# Altium schematic sheet TSAL23-ESF-2.SchDoc
size A4
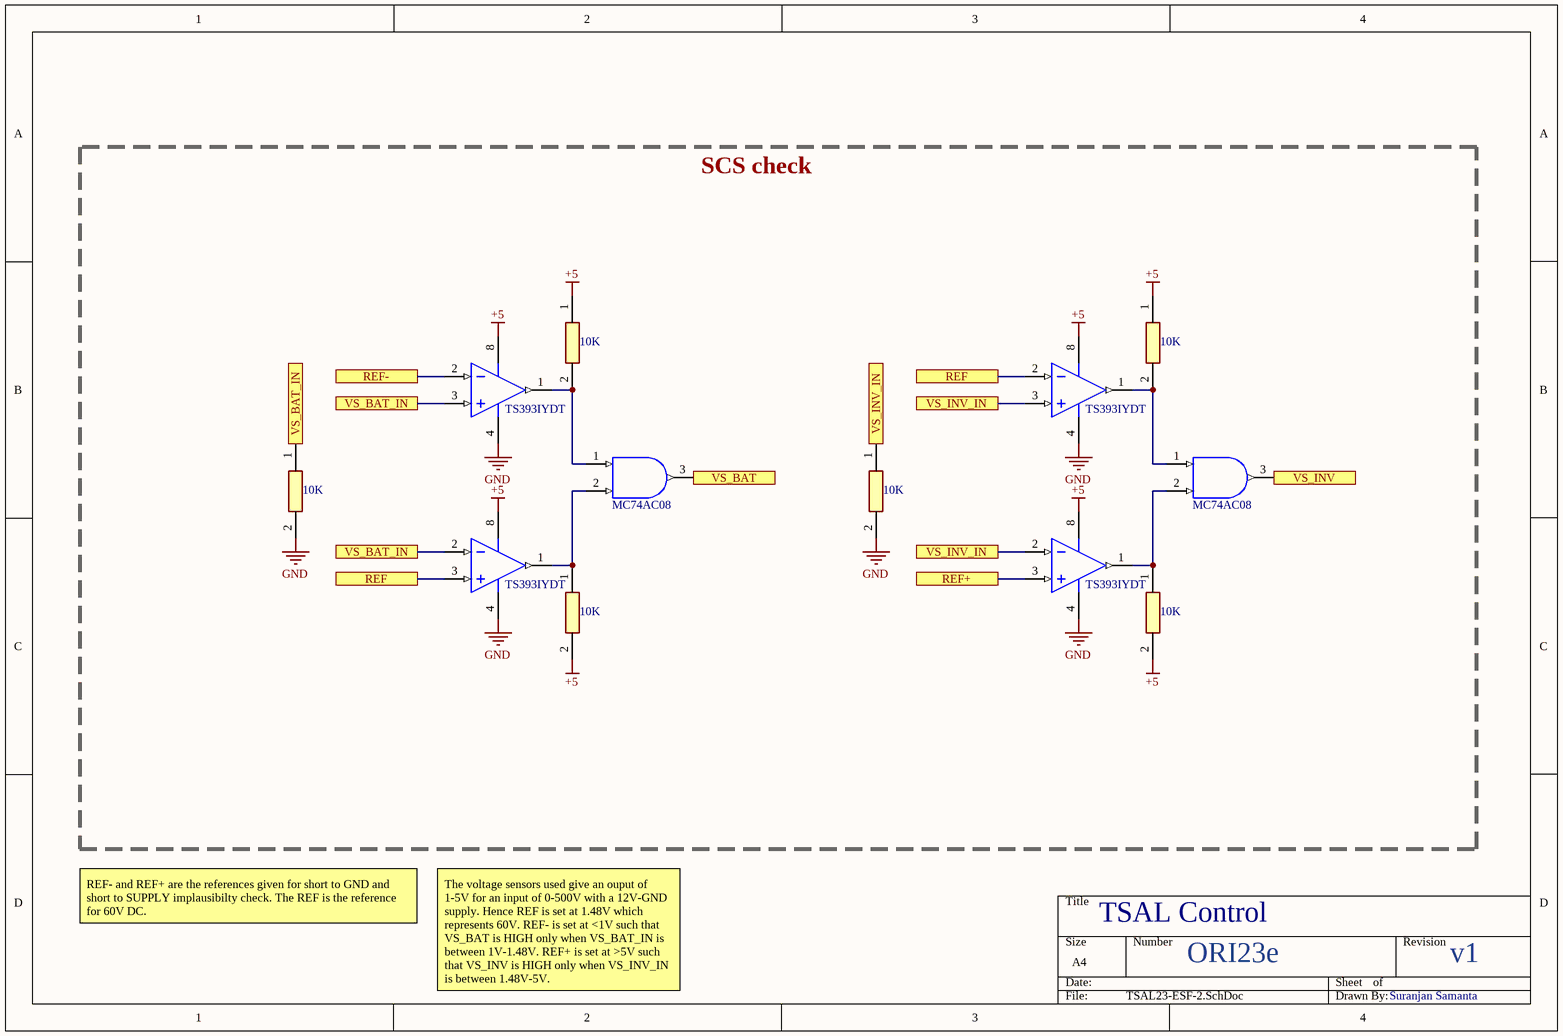
[diagram p0: TSAL23-ESF-2.SchDoc]

## Parts
(Parts that share a designator on the sheet are numbered #1, #2 ... from top to bottom, then left to right.)
R?#1  10K  [RESC3126X60N]
R?#2  10K  [RESC3126X60N]
R?#3  10K  [RESC3126X60N]
R?#4  10K  [RESC3126X60N]
R?#5  10K  [RESC3126X60N]
R?#6  10K  [RESC3126X60N]
U?#1  TS393IYDT  [STM-SO-8_D_L]  (part A of 2)
U?#2  TS393IYDT  [STM-SO-8_D_L]  (part A of 2)
U?#3  MC74AC08  [PW0014A_N]  (part A of 5)
U?#4  MC74AC08  [PW0014A_N]  (part A of 5)
U?#5  TS393IYDT  [STM-SO-8_D_L]  (part A of 2)
U?#6  TS393IYDT  [STM-SO-8_D_L]  (part A of 2)

## Blocks framed on the sheet
SCS check: R?#1-R?#6 U?#1-U?#6

## Ports
REF, REF+, REF-, VS_BAT, VS_BAT_IN, VS_INV, VS_INV_IN

## Nets
+5: R?#1.1 R?#2.1 R?#5.2 R?#6.2 U?#1.8(VCC+) U?#2.8(VCC+) U?#5.8(VCC+) U?#6.8(VCC+)
GND: R?#3.2 R?#4.2 U?#1.4(VCC-) U?#2.4(VCC-) U?#5.4(VCC-) U?#6.4(VCC-)
REF: U?#2.2(IN1-) U?#5.3(IN1+) ; port REF
REF+: U?#6.3(IN1+) ; port REF+
REF-: U?#1.2(IN1-) ; port REF-
VS_BAT: U?#3.3(1Y) ; port VS_BAT
VS_BAT_IN: R?#3.1 U?#1.3(IN1+) U?#5.2(IN1-) ; port VS_BAT_IN
VS_INV: U?#4.3(1Y) ; port VS_INV
VS_INV_IN: R?#4.1 U?#2.3(IN1+) U?#6.2(IN1-) ; port VS_INV_IN
NetR?#1_2: R?#1.2 U?#1.1(OUT1) U?#3.1(1A)
NetR?#2_2: R?#2.2 U?#2.1(OUT1) U?#4.1(1A)
NetR?#5_1: R?#5.1 U?#3.2(1B) U?#5.1(OUT1)
NetR?#6_1: R?#6.1 U?#4.2(1B) U?#6.1(OUT1)

## Notes on the sheet
- REF- and REF+ are the references given for short to GND and short to SUPPLY implausibilty check. The REF is the reference for 60V DC.
- TSAL Control
- The voltage sensors used give an ouput of 1-5V for an input of 0-500V with a 12V-GND supply. Hence REF is set at 1.48V which represents 60V. REF- is set at <1V such that VS_BAT is HIGH only when VS_BAT_IN is between 1V-1.48V. REF+ is set at >5V such that VS_INV is HIGH only when VS_INV_IN is between 1.48V-5V.
- ORI23e
- v1
- Suranjan Samanta

## Library data of the parts
R?#1-R?#6 = RC1210JR-0710KL: Resistor; Manufacturer_Name: YAGEO (PHYCOMP); Datasheet Link: http://www.yageo.com/documents/recent/PYu-RC1210_51_RoHS_L_(4).pdf; Height: 0.6mm; Manufacturer_Part_Number: RC1210JR-0710KL; Mouser Part Number: 603-RC1210JR-0710KL; Mouser Price/Stock: https://www.mouser.com/Search/Refine.aspx?Keyword=603-RC1210JR-0710KL
U?#1 U?#2 U?#5 U?#6 = CMP-2000-06550-1: Low-Power, Dual-Voltage Comparator, 2 to 36 V, 0 to 70 degC, 8-Pin SOIC (SO), RoHS, Tape and Reel; Manufacturer: STMicroelectronics; Voltage - Supply, Single/Dual (±): 2V~36V,±1V~18V; Current - Input Bias (Max): 0.25µA@5V; Number of Elements: 2; Current - Output (Typ): 18mA@5V; Other Names: 497-1593-2; Voltage - Input Offset (Max): 5mV@30V; Output Type: CMOS,DTL,ECL,MOS,Open-Collector,TTL; EDA / CAD Models: DownloadfromAcceleratedDesigns; Other Related Documents: LM393ViewAllSpecificationsLM393ViewAllSpecifications; Online Catalog: Comparators-2elements; Current - Quiescent (Max): 2.5mA; Standard Package: 2,500; Manufacturer URL: http://www.st.com/; Package Description: 8-Pin Small Outline Integrated Circuit, Body 4.9 x 3.9 mm, Pitch 1.27 mm; Packaging: Tape&Reel(TR); Datasheet Version: Rev. 15, 02/2016; Category: IntegratedCircuits(ICs); Operating Temperature: 0°C~70°C; Mounting Type: SurfaceMount; Supplier Device Package: 8-SO; Datasheet URL: http://www.st.com/content/ccc/resource/technical/document/datasheet/group1/b4/cc/cf/13/18/28/44/f5/CD00000465/files/CD00000465.pdf/jcr:content/translations/en.CD00000465.pdf; Family: Linear-Comparators; Mounting Technology: SurfaceMount; Type: GeneralPurpose; Package Reference: SO-8; Package / Case: 8-SOIC(0.154",3.90mmWidth)
U?#3 U?#4 = CMP-0777-00390-3: Quadruple 2-Input Positive-AND Gates, PW0014A, LARGE T&R; Generic Part Number: SN74AHCT08; Manufacturer: Texas Instruments; Output Type: CMOS; VCC(Min)(V): 4.5; Technology Family: AHCT; tpd @ Nom Voltage(Max)(ns): 8; Bits(#): 4; Input Type: TTL; Schmitt Trigger: No; Voltage(Nom)(V): 5; VCC(Max)(V): 5.5; Output Drive (IOL/IOH)(Max)(mA): -8/8; Rating: Catalog; ICC @ Nom Voltage(Max)(mA): 0.02; F @ Nom Voltage(Max)(Mhz): 70; DatasheetVersion: SCLS237M; Operating Temperature Range(C): -40 to 125,-40 to 85; PackageReference: PW0014A